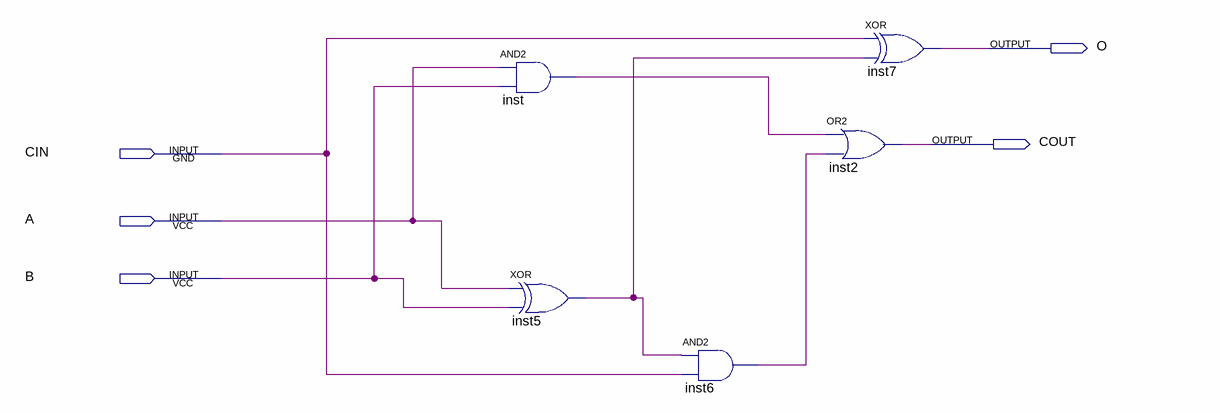
[diagram p0: schematic sheet]
// Quartus schematic FULL_ADDER_1bit.bdf as structural Verilog: 5 symbols, 5 pins
module FULL_ADDER_1bit (
  input  CIN,
  input  A,
  input  B,
  output O,
  output COUT
);

  wire inst5_out, inst6_out, inst_out;

  and inst (inst_out, A, B);
  xor inst5 (inst5_out, A, B);
  and inst6 (inst6_out, inst5_out, CIN);
  or inst2 (COUT, inst_out, inst6_out);
  xor inst7 (O, CIN, inst5_out);
endmodule
